# Altium schematic sheet Sheet3.SchDoc
size A4
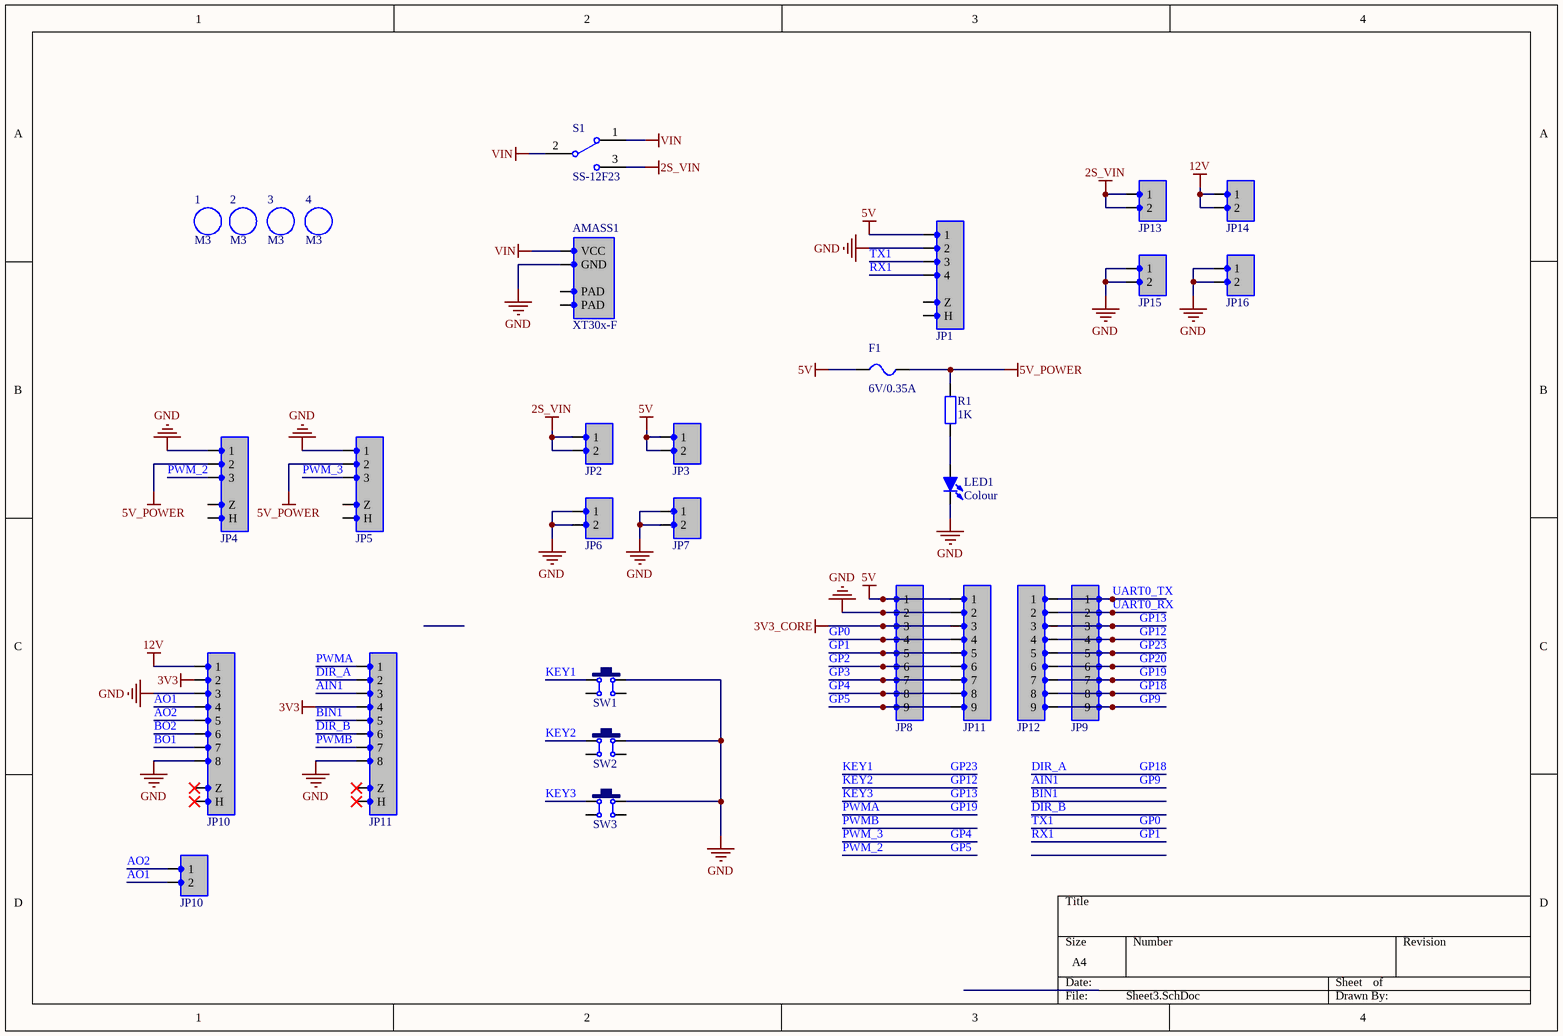
[diagram p0: Sheet3.SchDoc]

## Parts
(Parts that share a designator on the sheet are numbered #1, #2 ... from top to bottom, then left to right.)
1  M3  [M3 125X200]
2  M3  [M3 125X200]
3  M3  [M3 125X200]
4  M3  [M3 125X200]
AMASS1  XT30x-F  [XT30U-M]
F1  6V/0.35A  [FU 0805]
JP1  HDR-1X4  [HDR2.54-LI-4P]  (value not drawn)
JP2  HDR-1X2  [HDR2.54-LI-2P]  (value not drawn)
JP3  HDR-1X2  [HDR2.54-LI-2P]  (value not drawn)
JP4  HDR-1X3  [HDR2.54-LI-3P]  (value not drawn)
JP5  HDR-1X3  [HDR2.54-LI-3P]  (value not drawn)
JP6  HDR-1X2  [HDR2.54-LI-2P]  (value not drawn)
JP7  HDR-1X2  [HDR2.54-LI-2P]  (value not drawn)
JP8  HDR-1X9  [HDR2.54-M-LI-9P]  (value not drawn)
JP9  HDR-1X9  [HDR2.54-M-LI-9P]  (value not drawn)
JP10#1  HDR-1X8  [HDR2.54-M-LI-8P]  (value not drawn)
JP10#2  HDR-1X2  [HDR2.54-LI-2P]  (value not drawn)
JP11#1  HDR-1X9  [HDR2.54-LI-9P]  (value not drawn)
JP11#2  HDR-1X8  [HDR2.54-M-LI-8P]  (value not drawn)
JP12  HDR-1X9  [HDR2.54-LI-9P]  (value not drawn)
JP13  HDR-1X2  [HDR2.54-LI-2P]  (value not drawn)
JP14  HDR-1X2  [HDR2.54-LI-2P]  (value not drawn)
JP15  HDR-1X2  [HDR2.54-LI-2P]  (value not drawn)
JP16  HDR-1X2  [HDR2.54-LI-2P]  (value not drawn)
LED1  Colour  [LED 0805G]
R1  1K  [R 0805_M]
S1  SS-12F23  [SS-12D10]
SW1  6x6x5  [TSW SMD-3*4*2]  (value not drawn)
SW2  6x6x5  [TSW SMD-3*4*2]  (value not drawn)
SW3  6x6x5  [TSW SMD-3*4*2]  (value not drawn)

## Nets
2S_VIN: JP2.1 JP2.2 JP13.1 JP13.2 S1.3
3V3: JP10#1.2 JP11#2.4
3V3_CORE: JP8.3 JP11#1.3
5V: F1.1 JP1.1 JP3.1 JP3.2 JP8.1 JP11#1.1
5V_POWER: F1.2 JP4.2 JP5.2 R1.2
12V: JP10#1.1 JP14.1 JP14.2
GND: AMASS1.2(GND) JP1.2 JP4.1 JP5.1 JP6.1 JP6.2 JP7.1 JP7.2 JP8.2 JP10#1.3 JP10#1.8 JP11#1.2 JP11#2.8 JP15.1 JP15.2 JP16.1 JP16.2 LED1.2(K) SW1.2 SW2.2 SW3.2
VIN: AMASS1.1(VCC) S1.1 S1.2
AIN1: JP9.9 JP11#2.3 JP12.9  [also labelled GP9]
AO1: JP10#1.4 JP10#2.2
AO2: JP10#1.5 JP10#2.1
BIN1: JP11#2.5
BO1: JP10#1.7
BO2: JP10#1.6
DIR_A: JP9.8 JP11#2.2 JP12.8  [also labelled GP18]
DIR_B: JP11#2.6
GP0: JP1.3 JP8.4 JP11#1.4  [also labelled TX1]
GP1: JP1.4 JP8.5 JP11#1.5  [also labelled RX1]
GP2: JP8.6 JP11#1.6
GP3: JP8.7 JP11#1.7
GP4: JP5.3 JP8.8 JP11#1.8  [also labelled PWM_3]
GP5: JP4.3 JP8.9 JP11#1.9  [also labelled PWM_2]
GP12: JP9.4 JP12.4 SW2.1  [also labelled KEY2]
GP13: JP9.3 JP12.3 SW3.1  [also labelled KEY3]
GP19: JP9.7 JP11#2.1 JP12.7  [also labelled PWMA]
GP20: JP9.6 JP12.6
GP23: JP9.5 JP12.5 SW1.1  [also labelled KEY1]
PWMB: JP11#2.7
UART0_RX: JP9.2 JP12.2
UART0_TX: JP9.1 JP12.1
NetLED1_1: LED1.1(A) R1.1

Not connected (* = marked no-connect by the designer): AMASS1 0(PAD) 100(PAD); JP1 0(Z) 100(H); JP4 0(Z) 100(H); JP5 0(Z) 100(H); JP10#1 0(Z)* 100(H)*; JP11#2 0(Z)* 100(H)*; SW1 3 4; SW2 3 4; SW3 3 4

## Library data of the parts
1-4 = M3: 铜柱孔; 版权归属: 源创客; BOM名称: 铜柱孔; 学习资源: www.ooocke.com
AMASS1 = XT30: Amass防打火电源接口，XT30系列
F1 = FU: 贴片保险丝; 版权归属: 源创客; BOM名称: 贴片保险丝; 学习资源: www.ooocke.com
JP1 = Header 4: 4P接插件; 版权归属: 源创客; BOM名称: 4P接插件; 学习资源: www.ooocke.com
JP2 JP3 JP6 JP7 JP10#2 JP13-JP16 = Header 2: 2P接插件; 版权归属: 源创客; BOM名称: 2P接插件; 学习资源: www.ooocke.com
JP4 JP5 = Header 3: 3P接插件; 版权归属: 源创客; BOM名称: 3P接插件; 学习资源: www.ooocke.com
JP8 JP9 JP11#1 JP12 = Header 9: 9P接插件; 版权归属: 源创客; BOM名称: 9P接插件; 学习资源: www.ooocke.com
JP10#1 JP11#2 = Header 8: 8P接插件; 版权归属: 源创客; BOM名称: 8P接插件; 学习资源: www.ooocke.com
LED1 = LED-SMD: 贴片LED; 版权归属: 源创客; BOM名称: 贴片LED; 学习资源: www.ooocke.com
R1 = R: 贴片电阻; 版权归属: 源创客; BOM名称: 贴片电阻; 学习资源: www.ooocke.com
S1 = SSW-1P: 1路拨动开关; BOM名称: 波动开关; 版权归属: 源创客; 学习资源: www.ooocke.com
SW1-SW3 = TSW SMD-6x6: 贴片6x6轻触开关; 版权归属: 源创客; BOM名称: 贴片6x6轻触开关; 学习资源: www.ooocke.com